# Altium schematic sheet Mosaic-Support.SchDoc
size A4; SheetNumber: 2; SheetTotal: 2
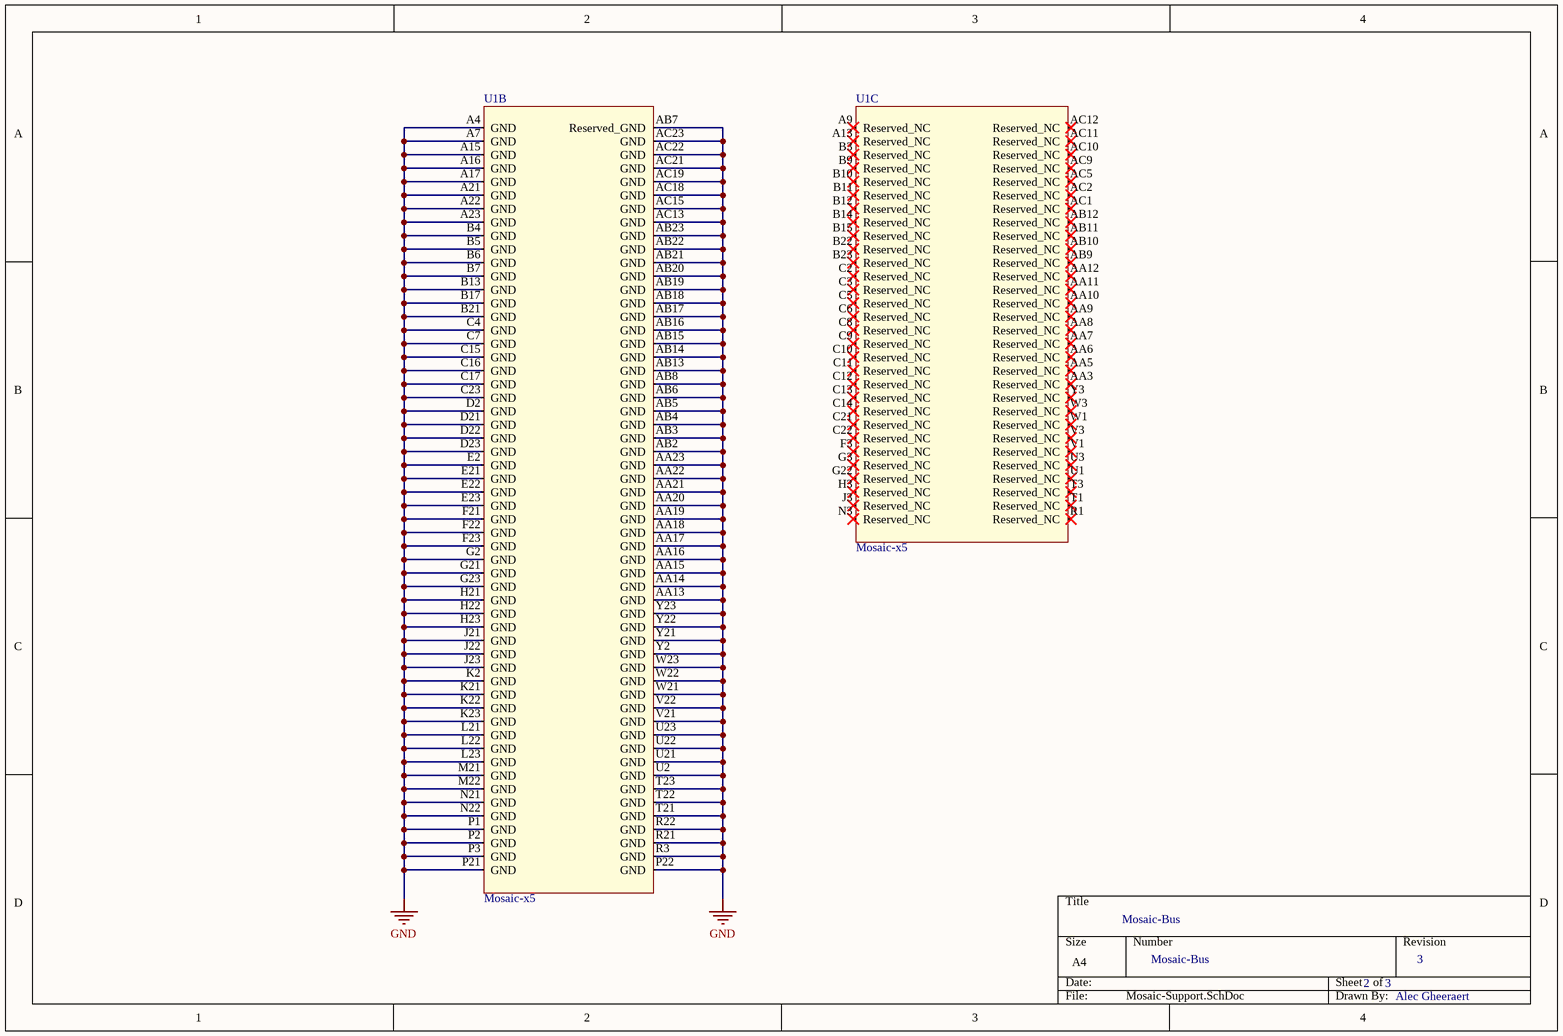
[diagram p0: Mosaic-Support.SchDoc]

## Parts
U1  Mosaic-x5  [Mosaic-x5]  (parts B,C of 3)

## Nets
GND: U1.A4(GND) U1.A7(GND) U1.A15(GND) U1.A16(GND) U1.A17(GND) U1.A21(GND) U1.A22(GND) U1.A23(GND) U1.AA13(GND) U1.AA14(GND) U1.AA15(GND) U1.AA16(GND) U1.AA17(GND) U1.AA18(GND) U1.AA19(GND) U1.AA20(GND) U1.AA21(GND) U1.AA22(GND) U1.AA23(GND) U1.AB2(GND) U1.AB3(GND) U1.AB4(GND) U1.AB5(GND) U1.AB6(GND) U1.AB7(Reserved_GND) U1.AB8(GND) U1.AB13(GND) U1.AB14(GND) U1.AB15(GND) U1.AB16(GND) U1.AB17(GND) U1.AB18(GND) U1.AB19(GND) U1.AB20(GND) U1.AB21(GND) U1.AB22(GND) U1.AB23(GND) U1.AC13(GND) U1.AC15(GND) U1.AC18(GND) U1.AC19(GND) U1.AC21(GND) U1.AC22(GND) U1.AC23(GND) U1.B4(GND) U1.B5(GND) U1.B6(GND) U1.B7(GND) U1.B13(GND) U1.B17(GND) U1.B21(GND) U1.C4(GND) U1.C7(GND) U1.C15(GND) U1.C16(GND) U1.C17(GND) U1.C23(GND) U1.D2(GND) U1.D21(GND) U1.D22(GND) U1.D23(GND) U1.E2(GND) U1.E21(GND) U1.E22(GND) U1.E23(GND) U1.F21(GND) U1.F22(GND) U1.F23(GND) U1.G2(GND) U1.G21(GND) U1.G23(GND) U1.H21(GND) U1.H22(GND) U1.H23(GND) U1.J21(GND) U1.J22(GND) U1.J23(GND) U1.K2(GND) U1.K21(GND) U1.K22(GND) U1.K23(GND) U1.L21(GND) U1.L22(GND) U1.L23(GND) U1.M21(GND) U1.M22(GND) U1.N21(GND) U1.N22(GND) U1.P1(GND) U1.P2(GND) U1.P3(GND) U1.P21(GND) U1.P22(GND) U1.R3(GND) U1.R21(GND) U1.R22(GND) U1.T21(GND) U1.T22(GND) U1.T23(GND) U1.U2(GND) U1.U21(GND) U1.U22(GND) U1.U23(GND) U1.V21(GND) U1.V22(GND) U1.W21(GND) U1.W22(GND) U1.W23(GND) U1.Y2(GND) U1.Y21(GND) U1.Y22(GND) U1.Y23(GND)

Not connected (* = marked no-connect by the designer): U1 A9(Reserved_NC)* A13(Reserved_NC)* AA3(Reserved_NC)* AA5(Reserved_NC)* AA6(Reserved_NC)* AA7(Reserved_NC)* AA8(Reserved_NC)* AA9(Reserved_NC)* AA10(Reserved_NC)* AA11(Reserved_NC)* AA12(Reserved_NC)* AB9(Reserved_NC)* AB10(Reserved_NC)* AB11(Reserved_NC)* AB12(Reserved_NC)* AC1(Reserved_NC)* AC2(Reserved_NC)* AC5(Reserved_NC)* AC9(Reserved_NC)* AC10(Reserved_NC)* AC11(Reserved_NC)* AC12(Reserved_NC)* B3(Reserved_NC)* B9(Reserved_NC)* B10(Reserved_NC)* B11(Reserved_NC)* B12(Reserved_NC)* B14(Reserved_NC)* B15(Reserved_NC)* B22(Reserved_NC)* B23(Reserved_NC)* C2(Reserved_NC)* C3(Reserved_NC)* C5(Reserved_NC)* C6(Reserved_NC)* C8(Reserved_NC)* C9(Reserved_NC)* C10(Reserved_NC)* C11(Reserved_NC)* C12(Reserved_NC)* C13(Reserved_NC)* C14(Reserved_NC)* C21(Reserved_NC)* C22(Reserved_NC)* F3(Reserved_NC)* G3(Reserved_NC)* G22(Reserved_NC)* H3(Reserved_NC)* J3(Reserved_NC)* N3(Reserved_NC)* R1(Reserved_NC)* T1(Reserved_NC)* T3(Reserved_NC)* U1(Reserved_NC)* U3(Reserved_NC)* V1(Reserved_NC)* V3(Reserved_NC)* W1(Reserved_NC)* W3(Reserved_NC)* Y3(Reserved_NC)*

## Notes on the sheet
- Mosaic-Bus
- 2
- 3
- Alec Gheeraert

## Library data of the parts
U1 = CP-Mosaic-x5-7: Septentrio Mosaic x5